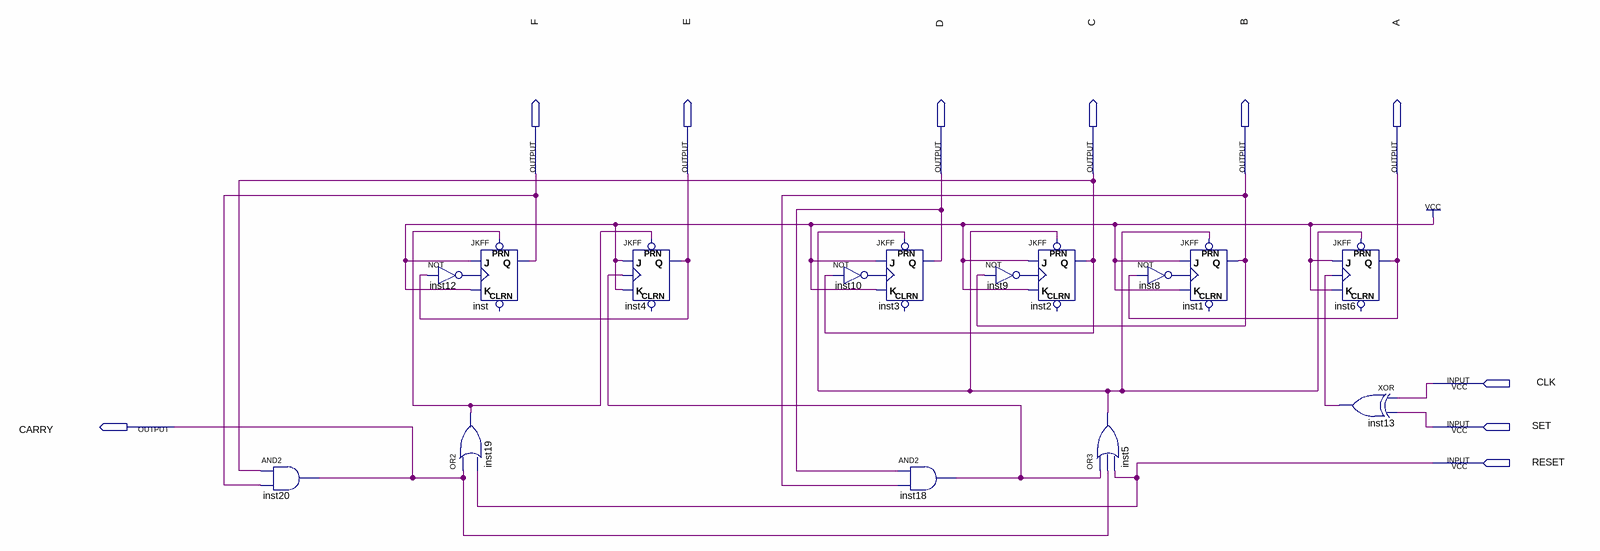
[diagram p0: schematic sheet]
// Quartus schematic contador0a23.bdf as structural Verilog: 15 symbols, 10 pins
module contador0a23 (
  input  CLK,
  input  SET,
  input  RESET,
  output F,
  output E,
  output D,
  output C,
  output B,
  output A,
  output CARRY
);

  wire inst5_out, inst8_out, inst9_out, inst10_out, inst12_out, inst13_out, inst18_out, inst19_out;

  and inst20 (CARRY, C, F);
  not inst12 (inst12_out, E);
  or inst19 (inst19_out, CARRY, RESET);
  JKFF inst (.PRN(inst19_out), .K(1'b1), .J(1'b1), .CLK(inst12_out), .Q(F));  // open: CLRN
  JKFF inst4 (.PRN(inst19_out), .K(1'b1), .J(1'b1), .CLK(inst18_out), .Q(E));  // open: CLRN
  not inst10 (inst10_out, C);
  JKFF inst3 (.PRN(inst5_out), .K(1'b1), .J(1'b1), .CLK(inst10_out), .Q(D));  // open: CLRN
  and inst18 (inst18_out, D, B);
  JKFF inst2 (.PRN(inst5_out), .K(1'b1), .J(1'b1), .CLK(inst9_out), .Q(C));  // open: CLRN
  not inst9 (inst9_out, B);
  or inst5 (inst5_out, inst18_out, CARRY, RESET);
  not inst8 (inst8_out, A);
  JKFF inst1 (.PRN(inst5_out), .K(1'b1), .J(1'b1), .CLK(inst8_out), .Q(B));  // open: CLRN
  JKFF inst6 (.PRN(inst5_out), .K(1'b1), .J(1'b1), .CLK(inst13_out), .Q(A));  // open: CLRN
  xor inst13 (inst13_out, CLK, SET);
endmodule
